# EAGLE design ESP8266-IoT_Expansion (EAGLE 9.6.1)
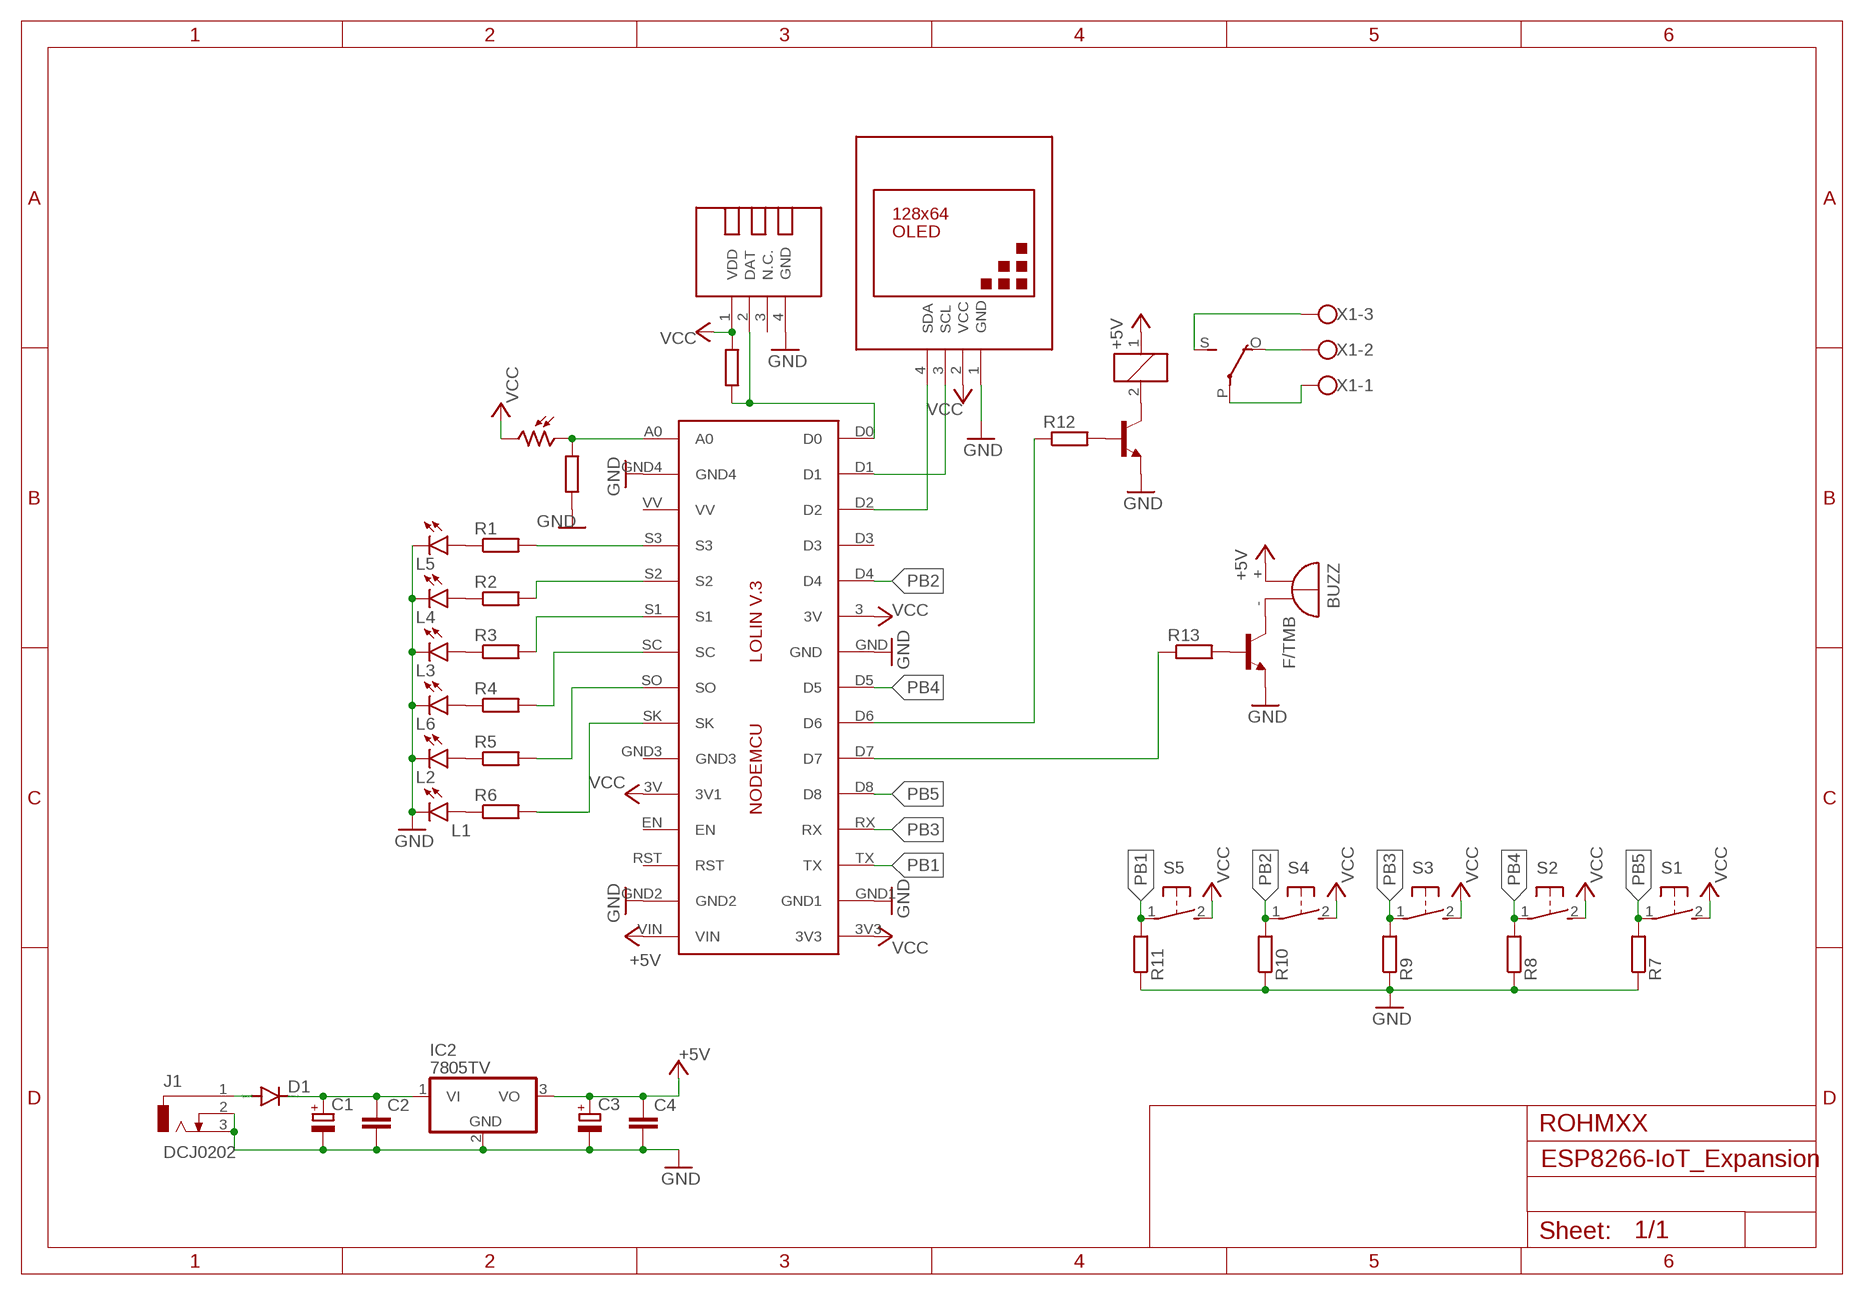
[diagram p0: schematic, sheet 1]

## Parts
BUZZ  F/TMB  [F/TMB]
C1  CPOL-EUE5-10.5  [E5-10,5]
C2  C-EU075-032X103  [C075-032X103]
C3  CPOL-EUE5-10.5  [E5-10,5]
C4  C-EU075-032X103  [C075-032X103]
D1  1N4007  1N4148DO35-7  [DO35-7]
DHT-11  TEMP-HUM-SENSOR-DHT11  [TEMP-HUM-SENSOR-DHT11]
IC1  LOLINV3  [LOLINV3]
IC2  7805TV  [TO220V]
J1  DCJ0202  [DCJ0202]
K1  G5LE  [G5LE]
L1  LED3MM  [LED3MM]
L2  LED3MM  [LED3MM]
L3  LED3MM  [LED3MM]
L4  LED3MM  [LED3MM]
L5  LED3MM  [LED3MM]
L6  LED3MM  [LED3MM]
LDR  V1060_21  [TO-5_V10]
R1  R-EU_0207/7  [0207/7]
R2  R-EU_0207/7  [0207/7]
R3  R-EU_0207/7  [0207/7]
R4  R-EU_0207/7  [0207/7]
R5  R-EU_0207/7  [0207/7]
R6  R-EU_0207/7  [0207/7]
R7  R-EU_0207/7  [0207/7]
R8  R-EU_0207/7  [0207/7]
R9  R-EU_0207/7  [0207/7]
R10  R-EU_0207/7  [0207/7]
R11  R-EU_0207/7  [0207/7]
R12  R-EU_0207/7  [0207/7]
R13  R-EU_0207/7  [0207/7]
R14  R-EU_0207/7  [0207/7]
R15  R-EU_0207/7  [0207/7]
S1  DTS-3  [DTS-3]
S2  DTS-3  [DTS-3]
S3  DTS-3  [DTS-3]
S4  DTS-3  [DTS-3]
S5  DTS-3  [DTS-3]
T1  2N3904  [TO92]
T2  2N3904  [TO92]
U$1  DISPLAY-OLED-128X64-I2C  [DISPLAY-OLED-128X64-I2C]
X1  W237-103  [W237-103]

## Nets
+5V: BUZZ.+ C3.+ C4.1 IC1.VIN IC2.3(VO) K1.1
GND: C1.- C2.2 C3.- C4.2 DHT-11.4(GND) IC1.GND IC1.GND1 IC1.GND2 IC1.GND4 IC2.2(GND) J1.2 J1.3 L1.K(C) L2.K(C) L3.K(C) L4.K(C) L5.K(C) L6.K(C) R7.1 R8.1 R9.1 R10.1 R11.1 R14.1 T1.3(E) T2.3(E) U$1.1(GND)
N$1: L5.A R1.1
N$2: L4.A R2.1
N$3: L3.A R3.1
N$4: L6.A R4.1
N$5: L2.A R5.1
N$6: L1.A R6.1
N$7: R13.2 T1.2(B)
N$8: BUZZ.- T1.1(C)
N$9: R12.2 T2.2(B)
N$10: K1.2 T2.1(C)
N$11: IC1.A0 LDR.1 R14.2
N$12: K1.O(2:O) X1.2
N$13: K1.S(2:S) X1.3
N$18: DHT-11.2(DAT) IC1.D0 R15.2
N$19: K1.P(2:P) X1.1
N$21: IC1.S3 R1.2
N$22: IC1.S2 R2.2
N$23: IC1.S1 R3.2
N$24: IC1.SC R4.2
N$25: IC1.SO R5.2
N$26: IC1.SK R6.2
N$27: C1.+ C2.1 D1.C IC2.1(VI)
N$28: IC1.D7 R13.1
N$29: IC1.D6 R12.1
N$30: D1.A J1.1
N$31: IC1.D2 U$1.4(SDA)
N$32: IC1.D1 U$1.3(SCL)
PB1: IC1.TX R11.2 S5.1
PB2: IC1.D4 R10.2 S4.1
PB3: IC1.RX R9.2 S3.1
PB4: IC1.D5 R8.2 S2.1
PB5: IC1.D8 R7.2 S1.1
VCC: DHT-11.1(VDD) IC1.3(3V) IC1.3V3 IC1.3V(3V1) LDR.2 R15.1 S1.2 S2.2 S3.2 S4.2 S5.2 U$1.2(VCC)
Unconnected: DHT-11.3(N.C.) IC1.D3 IC1.EN IC1.GND3 IC1.RST IC1.VV

## Notes on the sheet
- ROHMXX

## Library data of the parts
BUZZ = buzzer:F/TMB: BUZZER Source: Buerklin; OC_FARNELL: unknown; OC_NEWARK: unknown
C1 C3 = rcl:CPOL-EU: POLARIZED CAPACITOR, European symbol; SPICEPREFIX: C
C2 C4 = rcl:C-EU: CAPACITOR, European symbol; SPICEPREFIX: C
D1 = diode:1N4148: DIODE high speed (Philips)
DHT-11 = diy-modules:TEMP-HUM-SENSOR-DHT11: DHT11 - digital humidity & temperature sensor DHT11 datasheet available here: https://akizukidenshi.com/download/ds/aosong/DHT11.pdf Click here to find device on ebay.com <http://www.ebay.com/sch/dht11+digital+sensor>
IC1 = Lolin:LOLINV3
IC2 = linear:78*: Positive VOLTAGE REGULATOR Source: http://cache.national.com/ds/LM/LM78L05.pdf http://www.fairchildsemi.com/ds/LM/LM7805.pdf
J1 = con-jack:DCJ0202: DC POWER JACK Source: DCJ0202.pdf; OC_FARNELL: unknown; OC_NEWARK: unknown
K1 = relay:G5LE: RELAY 1 x switch, 10 A/120 V AC, 8 A/30 V DC, Omron; OC_FARNELL: unknown; OC_NEWARK: unknown
L1-L6 = led:LED: LED OSRAM: - CHIPLED LG R971, LG N971, LY N971, LG Q971, LY Q971, LO R971, LY R971 LH N974, LH R974 LS Q976, LO Q976, LY Q976 LO Q996 - Hyper CHIPLED LW Q18S LB Q993, LB Q99A, LB R99A - SideLED LS A670, LO A670, LY A670, LG A670, LP A670 LB A673, LV A673, LT A673, LW A673 LH A674 LY A675 LS A676, LA A676, LO A676, LY A676, LW A676 LS A679, LY A679, LG A679 - Hyper Micro SIDELED® LS Y876, LA Y876, LO Y876, LY Y876 LT Y87S - SmartLED LW L88C, LW L88S LB L89C, LB L89S, LG L890 LS L89K, LO L89K, LY L89K LS L896, LA L896, LO L896, LY L896 - TOPLED LS T670, LO T670, LY T670, LG T670, LP T670 LSG T670, LSP T670, LSY T670, LOP T670, LYG T670 LG T671, LOG T671, LSG T671 LB T673, LV T673, LT T673, LW T673 LH T674 LS T676, LA T676, LO T676, LY T676, LB T676, LH T676, LSB T676, LW T676 LB T67C, LV T67C, LT T67C, LS T67K, LO T67K, LY T67K, LW E67C LS E67B, LA E67B, LO E67B, LY E67B, LB E67C, LV E67C, LT E67C LW T67C LS T679, LY T679, LG T679 LS T770, LO T770, LY T770, LG T770, LP T770 LB T773, LV T773, LT T773, LW T773 LH T774 LS E675, LA E675, LY E675, LS T675 LS T776, LA T776, LO T776, LY T776, LB T776 LHGB T686 LT T68C, LB T68C - Hyper Mini TOPLED® LB M676 - Mini TOPLED Santana® LG M470 LS M47K, LO M47K, LY M47K Source: http://www.osram.convergy.de LUXEON: - LUMILED® LXK2-PW12-R00, LXK2-PW12-S00, LXK2-PW14-U00, LXK2-PW14-V00 LXK2-PM12-R00, LXK2-PM12-S00, LXK2-PM14-U00 LXK2-PE12-Q00, LXK2-PE12-R00, LXK2-PE12-S00, LXK2-PE14-T00, LXK2-PE14-U00 LXK2-PB12-K00, LXK2-PB12-L00, LXK2-PB12-M00, LXK2-PB14-N00, LXK2-PB14-P00, LXK2-PB14-Q00 LXK2-PR12-L00, LXK2-PR12-M00, LXK2-PR14-Q00, LXK2-PR14-R00 LXK2-PD12-Q00, LXK2-PD12-R00, LXK2-PD12-S00 LXK2-PH12-R00, LXK2-PH12-S00 LXK2-PL12-P00, LXK2-PL12-Q00, LXK2-PL12-R00 Source: www.luxeon.com KINGBRIGHT: KA-3528ASYC Source: www.kingbright.com
LDR = photo-elements:?1060*: Sensor Street Light control Source: http://optoelectronics.perkinelmer.com/content/Datasheets/DTS_PhotocellsB1060.pdf
R1-R15 = rcl:R-EU_: RESISTOR, European symbol; SPICEPREFIX: R
S1-S5 = switch-tact:DTS-3
T1 T2 = transistor:2N3904: NPN TRANSISTOR
U$1 = diy-modules:DISPLAY-OLED-128X64-I2C: 128x64 Dot Matrix OLED Module based on SSD1306 chip Variant with I2C interface More details available here: http://www.instructables.com/id/Monochrome-096-i2c-OLED-display-with-arduino-SSD13/ SSD1306 datasheet: https://cdn-shop.adafruit.com/datasheets/SSD1306.pdf Click here to find device on ebay.com <http://www.ebay.com/sch/oled+display+128x64+iic> Note: There are two variants: I2C and SPI. Search for the proper version.
X1 = con-wago-500:W237-103: WAGO SCREW CLAMP; MPN: 237-103; OC_FARNELL: unknown; OC_NEWARK: 18M7116

## Board
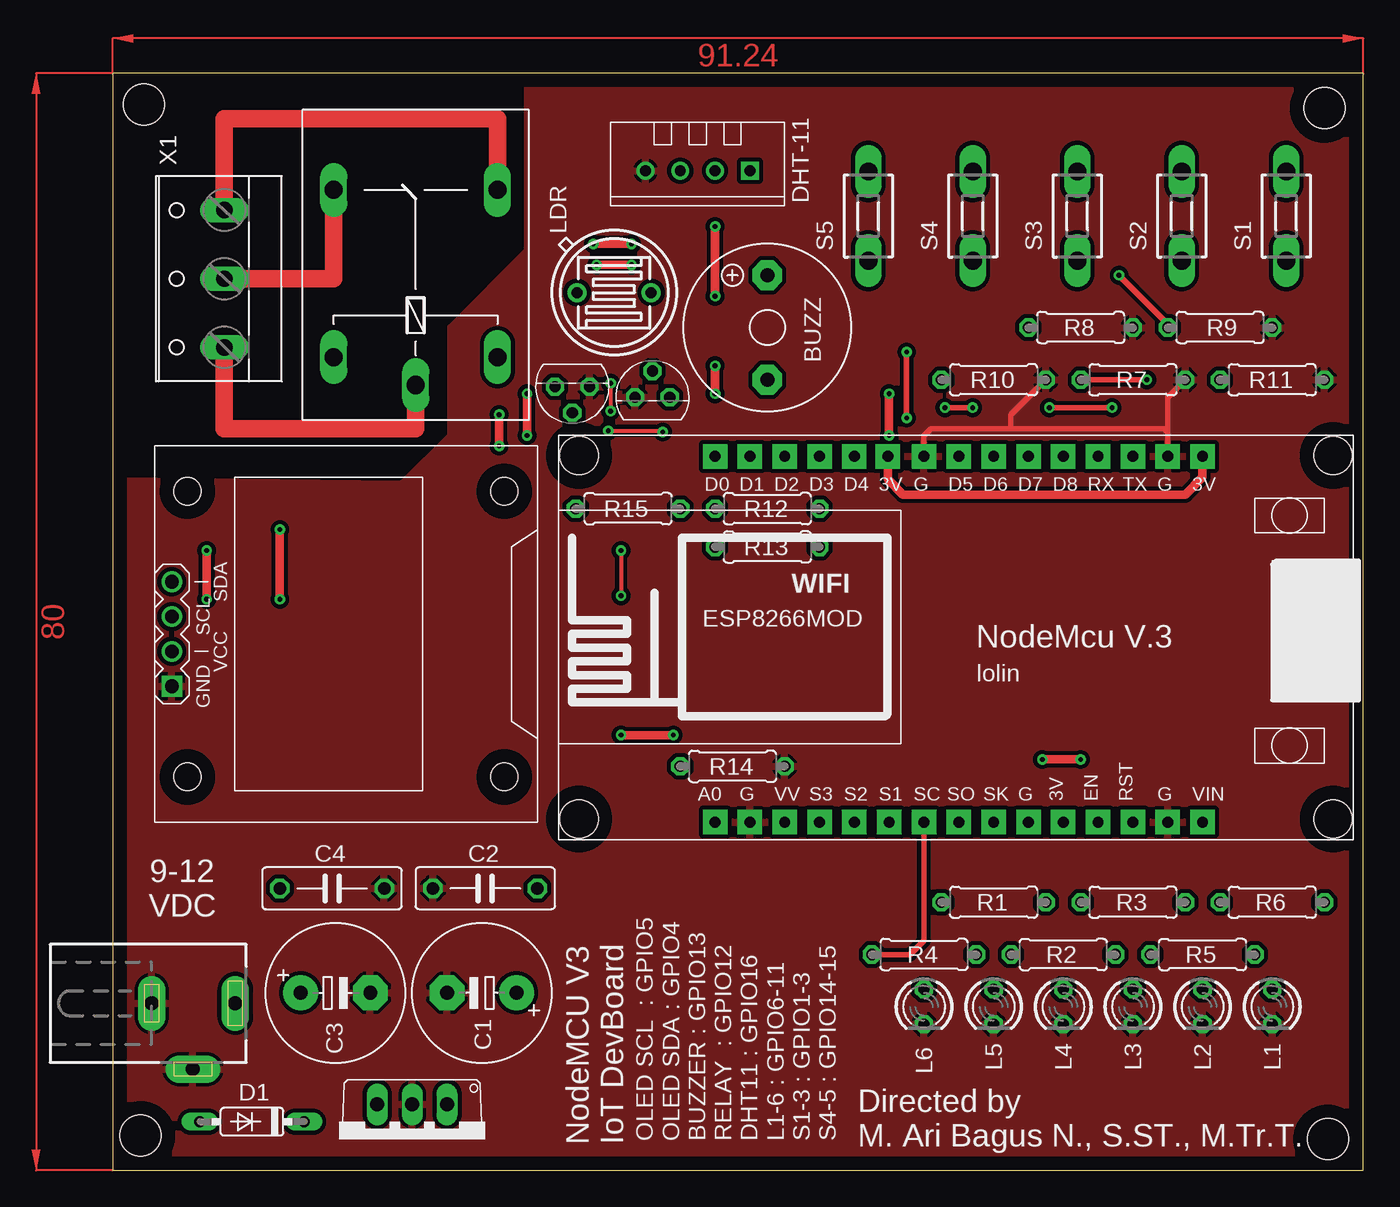
[diagram p1: board, top side]
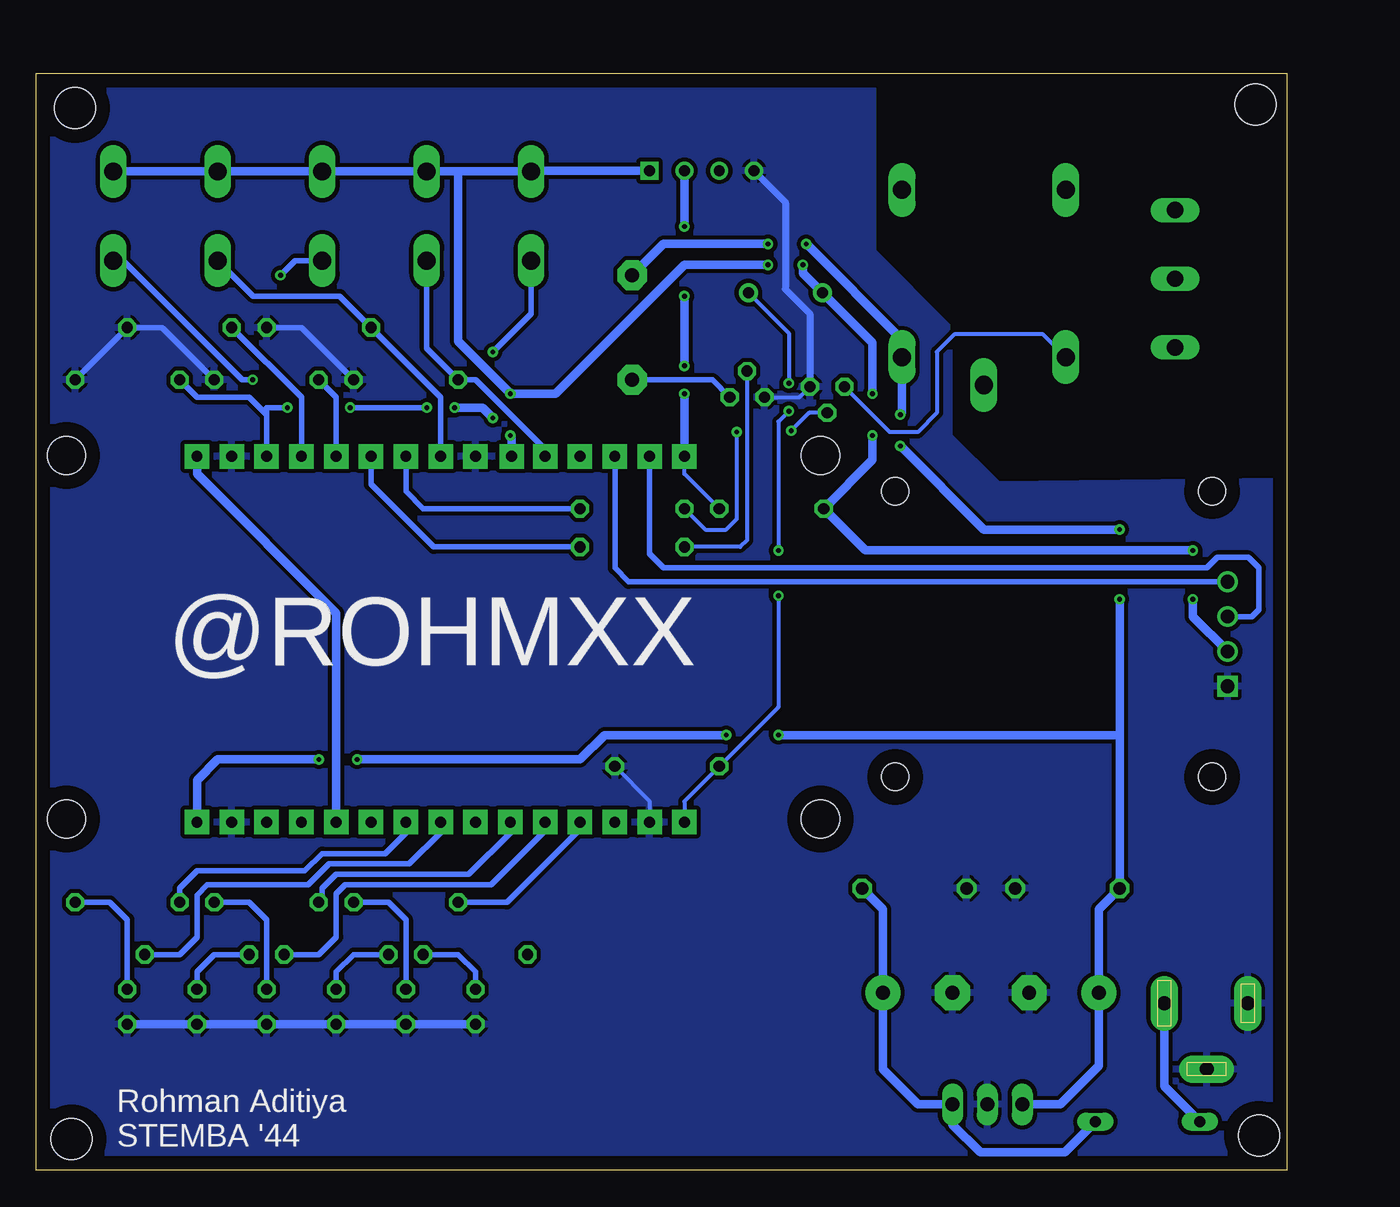
[diagram p2: board, bottom side, seen from below]

Size 91.24 x 80 mm. Coordinates in mm from the lower left corner, seen from the top.
Outline: 0,0 91.24,0 91.24,80 0,80 0,0
Copper layers (1*16): Top 0.035mm / dielectric 1.5mm / Bottom 0.035mm
Design rules "default": minimum track width 6mil, minimum drill 0.35mm, track to track 6mil, track to pad 6mil, pad to pad 6mil, via to via 6mil, smd to smd 6mil, copper to edge 40mil, drill to drill 6mil, minimum pad ring 10mil, minimum via ring 8mil, stop-mask expansion 4mil, vias tented up to drill 0mil, thermal gap 10mil
Holes 3 mm at 2.03,2.54 2.29,77.72 88.39,77.47 88.65,2.29

### Footprints (pad centres in the part's own frame; a part is rotated, then mirrored left to right if it is on the bottom)
F/TMB = drill 1.016 pad 2.159 octagon: + 3.81,0; - -3.81,0
E5-10,5 = drill 1.016 pad 2.54: + -2.54,0 | drill 1.016 pad 2.54 octagon: - 2.54,0
C075-032X103 = drill 0.914 octagon: 1 -3.81,0; 2 3.81,0
DO35-7 = drill 0.813 long: A 3.81,0; C -3.81,0
TEMP-HUM-SENSOR-DHT11 = drill 0.8 square: 1 -3.81,0 | drill 0.8: 2 -1.27,0; 3 1.27,0; 4 3.81,0
LOLINV3 = drill 0.8 pad 1.778 square: 3 24.03,27.94; 3V 46.99,27.94; 3V3 36.83,1.27; A0 11.43,1.27; D0 11.43,27.94; D1 13.97,27.94; D2 16.51,27.94; D3 19.05,27.94; D4 21.59,27.94; D5 29.21,27.94; D6 31.75,27.94; D7 34.29,27.94; D8 36.83,27.94; EN 39.37,1.27; GND 26.67,27.94; GND1 44.45,27.94; GND2 44.45,1.27; GND3 34.29,1.27; GND4 13.97,1.27; RST 41.91,1.27; RX 39.37,27.94; S1 24.13,1.27; S2 21.59,1.27; S3 19.05,1.27; SC 26.67,1.27; SK 31.75,1.27; SO 29.21,1.27; TX 41.91,27.94; VIN 46.99,1.27; VV 16.51,1.27 | hole 2.8: 56.5,28; 56.5,1.5; 1.5,1.5; 1.5,28
TO220V = drill 1.016 long: 1 -2.54,-2.54; 2 0,-2.54; 3 2.54,-2.54
DCJ0202 = drill 1 pad 2 long: 1 0,3.1; 2 4.8,0; 3 0,-3
G5LE = drill 1.321 long: 1 -7.493,-5.969; 2 -7.493,5.969; O 4.699,5.969; P -9.525,0; S 4.699,-5.969
LED3MM = drill 0.813 octagon: A -1.27,0; K 1.27,0
TO-5_V10 = drill 0.8 pad 1.4: 1 -2.7,0; 2 2.7,0
0207/7 = drill 0.813 octagon: 1 -3.81,0; 2 3.81,0
DTS-3 = drill 1.3 long: 1 -3.25,0; 2 3.25,0
TO92 = drill 0.813 octagon: 1 1.27,0; 2 0,1.905; 3 -1.27,0
DISPLAY-OLED-128X64-I2C = drill 1 square: 1 -3.81,12.7 | drill 1: 2 -1.27,12.7; 3 1.27,12.7; 4 3.81,12.7 | hole 2: -10.414,11.557; 10.414,11.557; 10.414,-11.557; -10.414,-11.557
W237-103 = drill 1.194 long: 1 -5,-1.29; 2 0,-1.29; 3 5,-1.29

### Placement (x,y rotation side)
BUZZ  47.75,61.47 90 top
C1  26.92,12.95 180 top
C2  27.18,20.57 180 top
C3  16.26,12.95 0 top
C4  16,20.57 0 top
D1  10.16,3.56 180 top
DHT-11  42.67,72.9 180 top
IC1  32.51,24.13 0 top
IC2  21.84,2.29 180 top
J1  5.84,12.19 270 top
K1  22.1,66.8 90 top
L1  84.58,11.94 270 top
L2  79.5,11.94 270 top
L3  74.42,11.94 270 top
L4  69.34,11.94 270 top
L5  64.26,11.94 270 top
L6  59.18,11.94 270 top
LDR  36.58,64.01 180 top
R1  64.26,19.56 180 top
R2  69.34,15.75 0 top
R3  74.42,19.56 180 top
R4  59.18,15.75 180 top
R5  79.5,15.75 0 top
R6  84.58,19.56 180 top
R7  74.42,57.66 180 top
R8  70.61,61.47 180 top
R9  80.77,61.47 180 top
R10  64.26,57.66 180 top
R11  84.58,57.66 180 top
R12  47.75,48.26 180 top
R13  47.75,45.47 180 top
R14  45.21,29.46 180 top
R15  37.59,48.26 0 top
S1  85.6,69.6 90 top
S2  77.98,69.6 90 top
S3  70.36,69.6 90 top
S4  62.74,69.6 90 top
S5  55.12,69.6 90 top
T1  39.37,56.39 0 top
T2  33.53,57.15 180 top
U$1  17.02,39.12 90 top
X1  6.86,65.02 90 top

### Tracks (layer width: path | path; a pad name or v marks a point on that pad's centre or on a via)
+5V  (via drill 0.35)
  Top 0.61: v37.85,67.56 v35.05,67.56 | v28.19,55.12 v28.19,52.83 | v12.19,46.74 v12.19,41.66 | v70.61,29.97 v67.82,29.97 | v40.89,31.75 v37.08,31.75
  Bottom 0.61: BUZZ.+ 45.47,67.56 v37.85,67.56 | v35.05,67.56 28.07,60.58 K1.1 28.07,55.24 v28.19,55.12 | IC2.3 16.51,4.83 13.72,7.62 C3.+ 13.72,19.05 C4.1 12.19,31.75 | v28.19,52.83 22.1,46.74 v12.19,46.74 | v12.19,41.66 12.19,31.75 | IC1.VIN 79.5,28.45 77.98,29.97 v70.61,29.97 | v67.82,29.97 51.56,29.97 49.78,31.75 v40.89,31.75 | v37.08,31.75 12.19,31.75
GND
  Top 0.406: IC1.GND 59.18,53.59 59.69,54.1 65.53,54.1 | 76.96,53.85 76.71,54.1 65.53,54.1 | 76.96,53.85 IC1.GND1 | R10.1 65.53,55.12 65.53,54.1 | R7.1 76.96,56.39 76.96,53.85
  Bottom 0.305: T1.3 35.56,56.39 T2.3 | R14.1 46.48,26.92 IC1.GND4
  Bottom 0.406: R10.1 71.88,61.47 R8.1 | R7.1 82.04,61.47 R9.1 R11.1
  Bottom 0.508: DHT-11.4 36.58,70.61 36.58,64.26 34.8,62.48 T2.3
  Bottom 0.61: L6.K L5.K L4.K L3.K L2.K L1.K
  pour Bottom (isolate 0.305): 91.06,79.76 30.23,79.76 30.23,67.06 24.64,61.47 24.64,53.59 21.08,50.04 0.25,50.29 0.25,0 91.06,0
  pour Top (isolate 0.305): 91.06,79.76 30.23,79.76 30.23,67.06 24.64,61.47 24.64,53.59 21.08,50.04 0.25,50.29 0.25,0 91.06,0
N$1
  Bottom 0.406: R1.1 65.53,19.56 64.26,18.29 L5.A
N$2
  Bottom 0.406: R2.1 68.07,15.75 69.34,14.48 L4.A
N$3
  Bottom 0.406: R3.1 75.69,19.56 74.42,18.29 L3.A
N$4
  Bottom 0.406: L6.A 59.18,14.48 60.45,15.75 R4.1
N$5
  Bottom 0.406: R5.1 78.23,15.75 79.5,14.48 L2.A
N$6
  Bottom 0.406: R6.1 85.85,19.56 84.58,18.29 L1.A
N$7
  Bottom 0.305: T1.2 39.37,45.97 39.88,45.47 R13.2
N$8
  Bottom 0.406: BUZZ.- 41.91,57.66 T1.1
N$9  (via drill 0.35)
  Top 0.305: v36.16,53.94 40.04,53.94 v40.13,53.85
  Bottom 0.305: R12.2 42.42,46.74 40.89,46.74 40.13,47.5 v40.13,53.85 | T2.2 34.85,55.24 v36.16,53.94
N$10
  Bottom 0.305: T2.1 28.96,53.85 26.92,53.85 25.53,55.24 25.53,59.69 24.26,60.96 17.78,60.96 K1.2
N$11  (via drill 0.35)
  Top 0.305: v36.32,57.4 v36.32,55.37 | v37.08,45.21 v37.08,41.91
  Bottom 0.305: LDR.1 36.32,61.05 v36.32,57.4 | 36.32,55.12 v36.32,55.37 37.08,54.61 v37.08,45.21 | v37.08,41.91 37.08,33.78 R14.2 43.94,26.92 IC1.A0
N$12
  Top 1.27: K1.O 16.13,65.02 X1.2
N$13
  Top 1.27: K1.S 28.07,76.71 8.15,76.71 X1.3
N$18  (via drill 0.35)
  Top 0.61: v43.94,68.83 v43.94,63.75 | v43.94,58.67 v43.94,56.64
  Bottom 0.305: R15.2 43.94,50.8 IC1.D0
  Bottom 0.61: DHT-11.2 v43.94,68.83 | v43.94,63.75 v43.94,58.67 | v43.94,56.64 IC1.D0
N$19
  Top 1.27: K1.P 22.1,54.1 8.15,54.1 X1.1
N$21
  Bottom 0.406: IC1.S3 51.56,24.89 56.9,19.56 R1.2
N$22
  Bottom 0.406: R2.2 70.61,15.75 69.34,17.02 69.34,20.19 68.71,20.83 58.04,20.83 54.1,24.77 IC1.S2
N$23
  Bottom 0.406: R3.2 70.36,19.81 70.36,20.57 69.34,21.59 59.69,21.59 56.64,24.64 IC1.S1
N$24
  Top 0.406: R4.2 58.17,15.75 59.18,16.76 IC1.SC
N$25
  Bottom 0.406: R5.2 80.77,15.75 79.5,17.02 79.5,20.07 78.74,20.83 71.37,20.83 69.85,22.35 64.01,22.35 61.72,24.64 IC1.SO
N$26
  Bottom 0.406: R6.2 80.77,20.57 79.5,21.84 71.63,21.84 70.36,23.11 65.79,23.11 64.26,24.64 IC1.SK
N$27
  Bottom 0.61: D1.C 16.21,1.32 22.35,1.32 24.38,3.35 IC2.1 26.92,4.83 29.46,7.37 C1.+ 29.46,19.05 C2.1
N$28
  Bottom 0.406: R13.1 62.23,45.47 66.8,50.04 IC1.D7
N$29
  Bottom 0.406: R12.1 62.99,48.26 64.26,49.53 IC1.D6
N$30
  Bottom 0.61: J1.1 8.94,6.15 D1.A
N$31
  Bottom 0.406: U$1.4 48.01,42.93 49.02,43.94 IC1.D2
N$32
  Bottom 0.406: U$1.3 2.54,40.39 2.03,40.89 2.03,43.94 2.79,44.7 5.08,44.7 5.84,43.94 45.47,43.94 46.48,44.96 IC1.D1
PB1  (via drill 0.35)
  Top 0.406: v57.91,59.69 v57.91,54.86 | v60.71,55.63 v62.74,55.63 | v68.33,55.63 v72.9,55.63
  Bottom 0.406: R11.2 79.5,56.39 75.69,56.39 74.42,55.12 | 74.42,55.12 74.42,55.63 v72.9,55.63 | 74.42,55.12 IC1.TX | S5.1 55.12,62.48 v57.91,59.69 | v62.74,55.63 v68.33,55.63
  Bottom 0.61: v60.71,55.63 58.67,55.63 v57.91,54.86
PB2
  Bottom 0.406: IC1.D4 54.1,52.58 59.18,57.66 R10.2 62.74,59.94 S4.1
PB3  (via drill 0.35)
  Top 0.406: v73.41,65.28 76.96,61.72 R9.2
  Bottom 0.406: R9.2 71.88,56.39 IC1.RX | 71.12,66.35 S3.1 72.34,66.35 v73.41,65.28
PB4
  Bottom 0.406: IC1.D5 61.72,56.39 R8.2 69.09,63.75 75.39,63.75 S2.1
PB5  (via drill 0.35)
  Top 0.406: v75.44,57.66 R7.2
  Bottom 0.406: R7.2 69.34,56.39 IC1.D8 | S1.1 84.89,66.35 76.2,57.66 v75.44,57.66
VCC  (via drill 0.35)
  Top 0.61: v56.64,53.59 v56.64,56.64 | IC1.3 56.54,50.39 57.66,49.28 78.23,49.28 79.5,50.55 IC1.3V | v6.86,45.21 v6.86,41.66 | v30.23,56.64 v30.23,53.59 | v37.85,66.04 v35.31,66.04
  Bottom 0.61: S1.2 S2.2 S3.2 S4.2 60.45,72.85 | 60.45,72.85 S5.2 55.07,72.9 DHT-11.1 | IC1.3 56.54,53.49 v56.64,53.59 | 60.45,72.85 60.45,60.45 v56.64,56.64 53.34,56.64 43.94,66.04 v37.85,66.04 | IC1.3V3 69.34,40.64 79.5,50.8 IC1.3V | v6.86,41.66 6.86,40.39 U$1.2 | v6.86,45.21 30.73,45.21 R15.1 30.23,51.82 v30.23,53.59 | v30.23,56.64 30.23,60.36 LDR.2 35.31,65.44 v35.31,66.04
(copper drawn outside any net)
  shapes: Top area x2

### Text on the board
tNames: 9-12 / VDC | Directed by / M. Ari Bagus N., S.ST., M.Tr.T. | NodeMCU V3 / IoT DevBoard | OLED SCL : GPIO5 / OLED SDA : GPIO4 / BUZZER : GPIO13 / RELAY : GPIO12 / DHT11 : GPIO16 / L1-6 : GPIO6-11 / S1-3 : GPIO1-3 / S4-5 : GPIO14-15
bNames: @ROHMXX | Rohman Aditiya / STEMBA '44